# EasyEDA Pro project BtPluggy.epro

# Schematic Schematics
Board Name: Board1; Create Date: 2026-01-23; Page Name: P1; Project Name: BtPluggy; Schematic Name: Schematics; Update Date: 2026-03-08; Company: EasyEDA.com; Page Size: A4; Version: V1.0
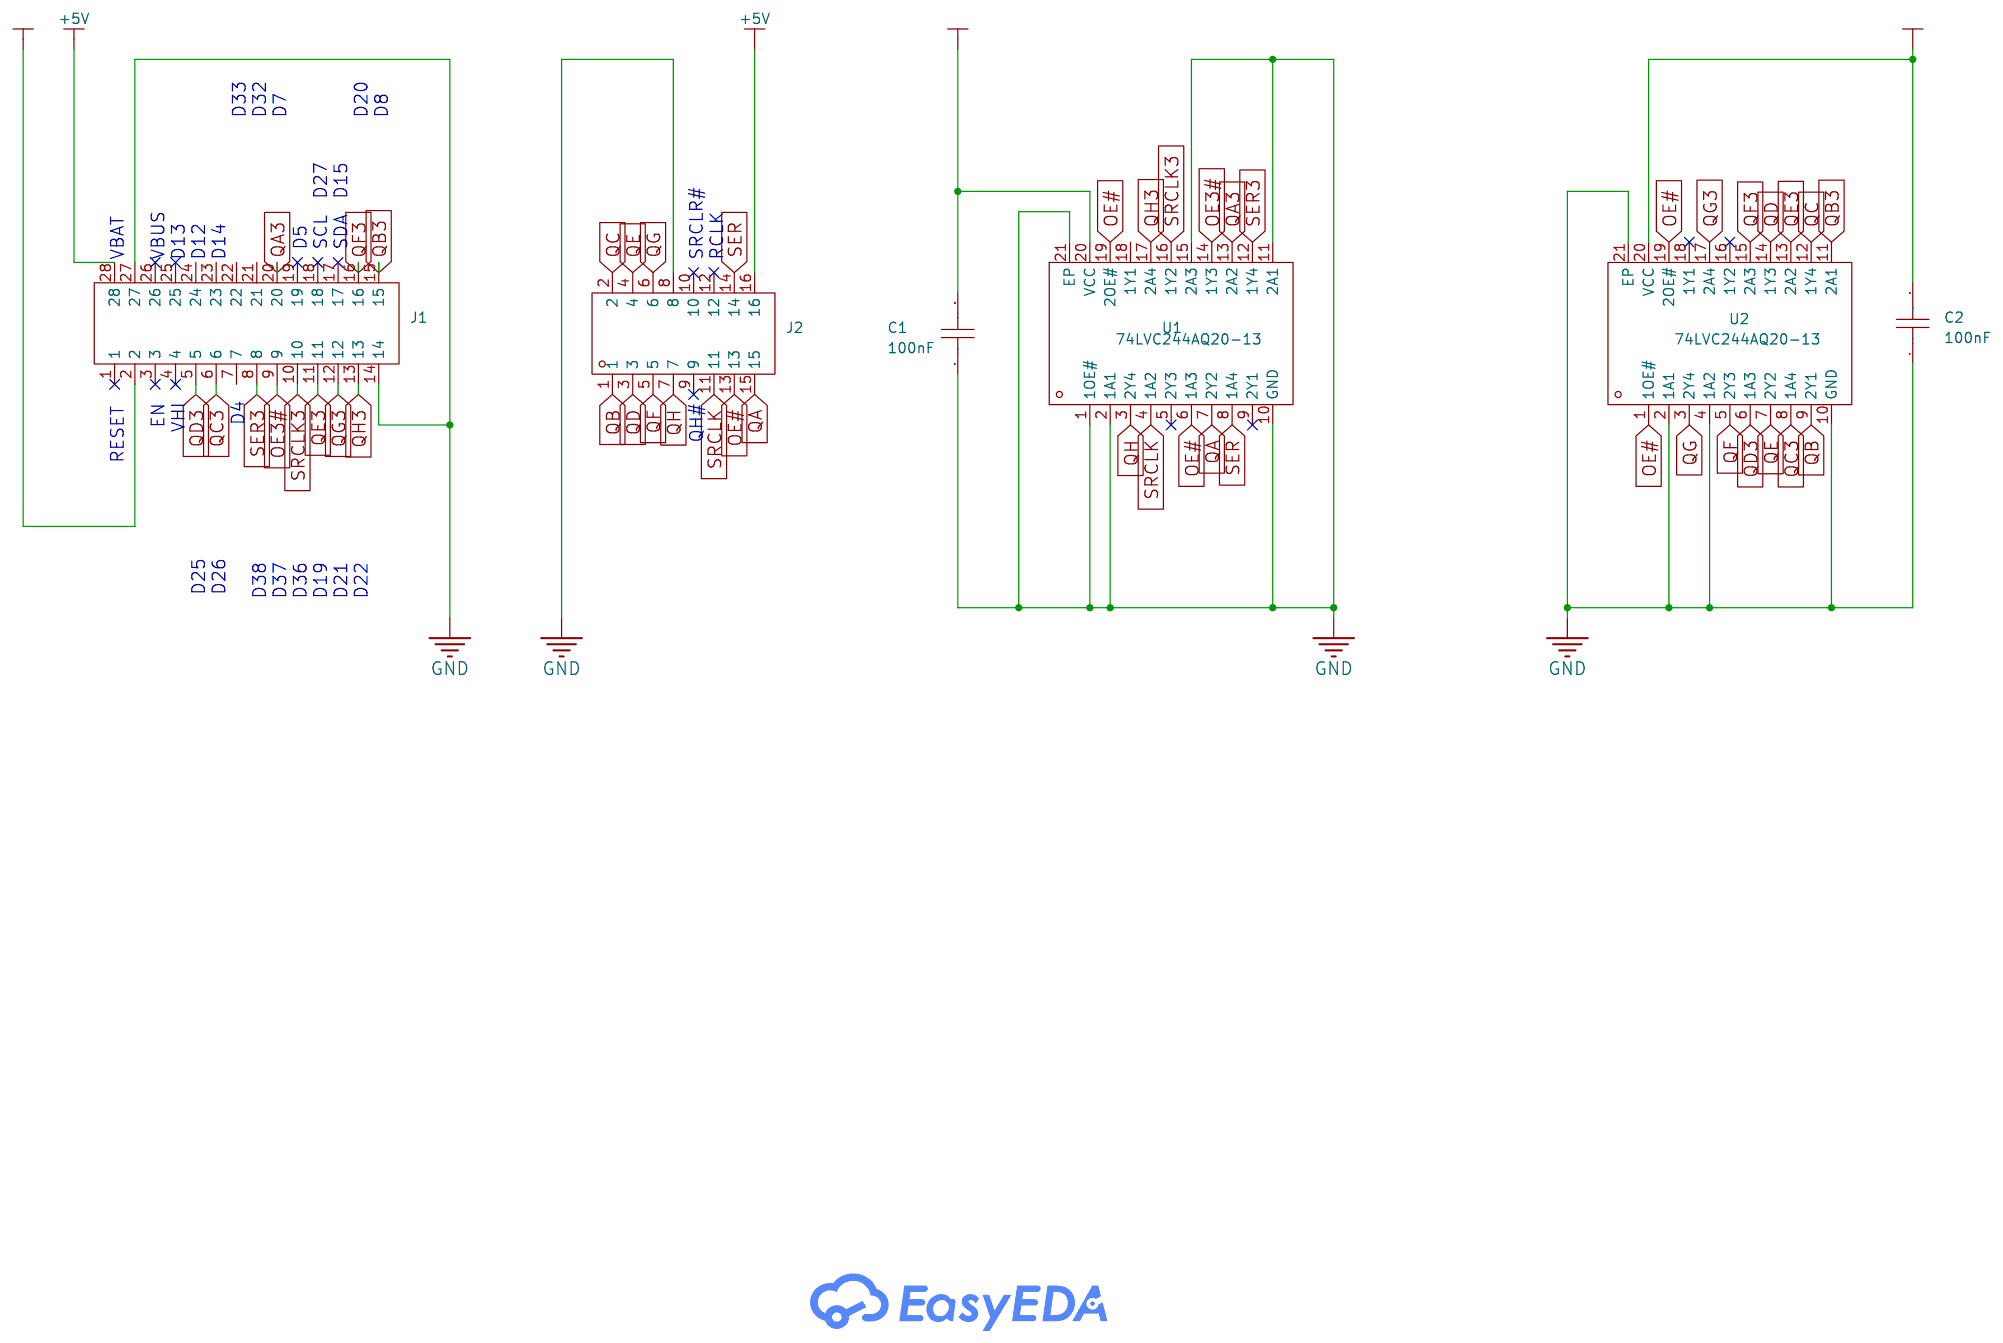
[diagram p0: schematic sheet]

## Parts
C1  100nF  [C0402]
C2  100nF  [C0402]
J1  100-286-100-1001-00  [DIP-28_L35.6-W17.8-P2.54-LS15.2-BL_DILB28P]  (no BOM)
J2  Z-100163200100100  [DIP-16_L20.3-W10.2-P2.54-LS7.6-BL]  (no BOM)
U1  74LVC244AQ20-13  [V-QFN4525-20_L4.5-W2.5-P0.50-BL]
U2  74LVC244AQ20-13  [V-QFN4525-20_L4.5-W2.5-P0.50-BL]

## Library data of the parts
C1 C2 = CL05B104KO5NNNC: Capacitance:100nF Tolerance:±10% Tolerance:±10% Voltage Rating:16V Temperature Coefficient:X7R; LCSC Part Name: 100nF ±10% 16V; Supplier Part: C1525; Manufacturer: SAMSUNG(三星); Supplier Footprint: 0402; JLCPCB Part Class: Basic Part; Datasheet: https://item.szlcsc.com/datasheet/CL05B104KO5NNNC/1877.html; Supplier: LCSC; Tolerance: ±10%; Voltage Rating: 16V; Temperature Coefficient: X7R
J1 = 100-286-100-1001-00: IC Type:DIP Pitch:2.54mm Row Spacing:15.24mm Circular Holes/Square Holes:Circular Holes Number of Positions:28P Operating Temperature Range:- Operating Temperature Range:-; LCSC Part Name: 间距2.54mm P数:28P 圆孔; Supplier Part: C2846073; Manufacturer: Nextron(正凌); Supplier Footprint: DIP-28; JLCPCB Part Class: Extended Part; Datasheet: https://atta.szlcsc.com/upload/public/pdf/source/20210723/C2846073_EB158C8AF85AB1D997D3E99E22413B30.pdf; Supplier: LCSC; IC Type: DIP; Pitch: 2.54mm; Row Spacing: 15.24mm; Circular Holes/Square Holes: Circular Holes; Number of Positions: 28P
J2 = Z-100163200100100: IC Type:DIP Pitch:2.54mm Row Spacing:7.62mm Circular Holes/Square Holes:Circular Holes Number of Positions:16P Operating Temperature Range:-55℃~+125℃ Operating Temperature Range:-55℃~+125℃; LCSC Part Name: 间距2.54mm P数:16P 圆孔; Supplier Part: C2886329; Manufacturer: Nextron(正凌); Supplier Footprint: DIP-16; JLCPCB Part Class: Extended Part; Datasheet: https://atta.szlcsc.com/upload/public/pdf/source/20210712/C115171_600538288BC4983AE5CE40C4C7984B52.pdf; Supplier: LCSC; IC Type: DIP; Pitch: 2.54mm; Row Spacing: 7.62mm; Circular Holes/Square Holes: Circular Holes; Number of Positions: 16P; Operating Temperature Range: -55℃~+125℃
U1 U2 = 74LVC244AQ20-13: Supplier Part: C460536; Manufacturer: DIODES(美台); Supplier Footprint: VQFN-20(2.5x4.5); JLCPCB Part Class: Extended Part; Datasheet: https://item.szlcsc.com/datasheet/74LVC244AQ20-13/464965.html; Supplier: LCSC

## Nets
+5V: J1.28 J2.16
GND: C1.1 C2.1 J1.14 J1.27 J2.8 U1.1(1OE#) U1.2(1A1) U1.10(GND) U1.11(2A1) U1.15(2A3) U1.21(EP) U2.2(1A1) U2.4(1A2) U2.10(GND) U2.21(EP)
V33: C1.2 C2.2 J1.2 U1.20(VCC) U2.20(VCC)
OE3#: J1.9 U1.14(1Y3)
OE#: J2.13 U1.6(1A3) U1.19(2OE#) U2.1(1OE#) U2.19(2OE#)
QA: J2.15 U1.7(2Y2)
QA3: J1.20 U1.13(2A2)
QB: J2.1 U2.9(2Y1)
QB3: J1.15 U2.11(2A1)
QC: J2.2 U2.12(1Y4)
QC3: J1.6 U2.8(1A4)
QD: J2.3 U2.14(1Y3)
QD3: J1.5 U2.6(1A3)
QE: J2.4 U2.7(2Y2)
QE3: J1.11 U2.13(2A2)
QF: J2.5 U2.5(2Y3)
QF3: J1.16 U2.15(2A3)
QG: J2.6 U2.3(2Y4)
QG3: J1.12 U2.17(2A4)
QH: J2.7 U1.3(2Y4)
QH3: J1.13 U1.17(2A4)
SER: J2.14 U1.8(1A4)
SER3: J1.8 U1.12(1Y4)
SRCLK: J2.11 U1.4(1A2)
SRCLK3: J1.10 U1.16(1Y2)

Not connected (* = marked no-connect by the designer): J1 1* 3* 4* 7 17* 18* 19* 21 22 23 24 25* 26*; J2 9* 10* 12*; U1 5(2Y3)* 9(2Y1)* 18(1Y1); U2 16(1Y2)* 18(1Y1)*

## Notes on the sheet
- D33
- D32
- D7
- D20
- D8
- D27
- D15
- D5
- SCL
- SDA
- VBAT
- VBUS
- D13
- D12
- D14
- SRCLR#
- RCLK
- EN
- VHI
- D4
- QH#
- RESET
- D25
- D26
- D38
- D37
- D36
- D19
- D21
- D22

# Board PCB1
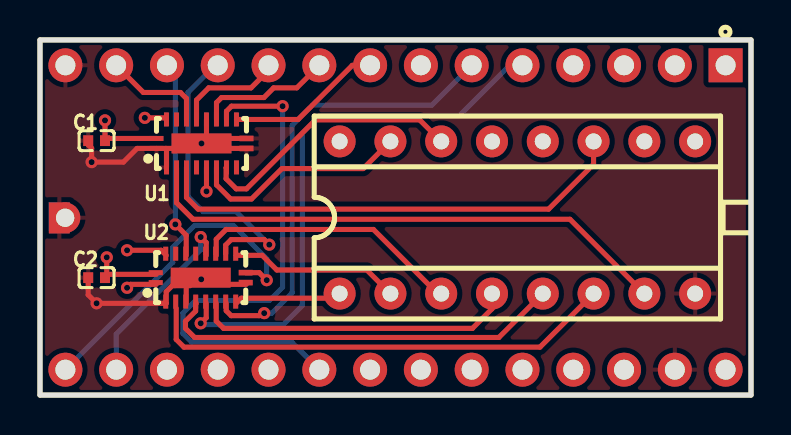
[diagram p1: board, top side]
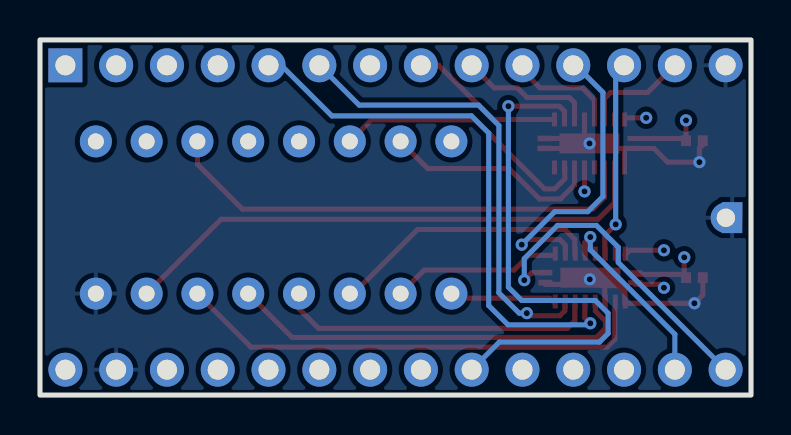
[diagram p2: board, bottom side, seen from below]

Outline 35.56 x 17.78 mm; copper layers: Top Layer, Inner1, Inner2, Bottom Layer. Coordinates in mm from the lower left corner of the outline.
Outline path: rectangle 35.56,0 0,17.78
Stack: Top Layer 0.035mm Outer layer thickness 1oz / Dielectric1 0.2104mm 7628 RC49% 8.6mil / Inner1 0.0152mm Inner layer thickness / Dielectric2 1.065mm 1.1mm H/HOZ Copper / Inner2 0.0152mm Inner layer thickness / Dielectric3 0.2104mm 7628 RC49% 8.6mil / Bottom Layer 0.035mm Outer layer thickness 1oz

## Design rules (mm)
template: JLCPCB Capability(Two Layers Board)
spacing copperThickness1oz (default): track to track 0.102, other pairs 0.152 to 0.3
spacing copperThickness2oz: track to track 0.203, other pairs 0.152 to 0.3
track width copperThickness1oz (default): min 0.127, default 0.254, max 2.54
track width copperThickness2oz: min 0.203, default 0.254, max 2.54
differential pair differentialPair (default): width min 0.127, default 0.254, max 2.54; gap min 0.152, default 0.152
via viaSize (default): diameter min 0.5, default 0.61, max 10; hole min 0.3, default 0.305, max 6.3

## Placement (name value [footprint] x y rotation side)
C1  100nF  [C0402]  2.83 12.74 0 top
C2  100nF  [C0402]  2.83 5.88 0 top
J1  100-286-100-1001-00  [DIP-28_L35.6-W17.8-P2.54-LS15.2-BL_DILB28P]  17.78 8.89 180 top
J2  Z-100163200100100  [DIP-16_L20.3-W10.2-P2.54-LS7.6-BL]  23.88 8.89 0 top
NOREF  -  [Pad_e25]  0.97 8.87 0 top
NOREF#2  -  [Pad_e24]  0.94 8.89 0 top
NOREF#3  -  [Pad_e12]  1.26 8.88 0 top
U1  74LVC244AQ20-13  [V-QFN4525-20_L4.5-W2.5-P0.50-BL]  8.08 12.6 0 top
U2  74LVC244AQ20-13  [V-QFN4525-20_L4.5-W2.5-P0.50-BL]  8.04 5.88 0 top

## Footprints (pads in the part's own frame, mm; a bottom-side part is the same pattern mirrored in y, then rotated)
C0402
  rect 0.5x0.54 smd: 1(-0.42,0) 2(0.42,0)
DIP-16_L20.3-W10.2-P2.54-LS7.6-BL
  round 1.6 hole 0.8: 1(-8.89,-3.81) 2(-6.35,-3.81) 3(-3.81,-3.81) 4(-1.27,-3.81) 5(1.27,-3.81) 6(3.81,-3.81) 7(6.35,-3.81) 8(8.89,-3.81) 9(8.89,3.81) 10(6.35,3.81) 11(3.81,3.81) 12(1.27,3.81) 13(-1.27,3.81) 14(-3.81,3.81) 15(-6.35,3.81) 16(-8.89,3.81)
DIP-28_L35.6-W17.8-P2.54-LS15.2-BL_DILB28P
  rect 1.7x1.7 hole 1: 1(-16.51,-7.62)
  round 1.7 hole 1: 2(-13.97,-7.62) 3(-11.43,-7.62) 4(-8.89,-7.62) 5(-6.35,-7.62) 6(-3.81,-7.62) 7(-1.27,-7.62) 8(1.27,-7.62) 9(3.81,-7.62) 10(6.35,-7.62) 11(8.89,-7.62) 12(11.43,-7.62) 13(13.97,-7.62) 14(16.51,-7.62) 15(16.51,7.62) 16(13.97,7.62) 17(11.43,7.62) 18(8.89,7.62) 19(6.35,7.62) 20(3.81,7.62) 21(1.27,7.62) 22(-1.268,7.62) 23(-3.81,7.62) 24(-6.35,7.62) 25(-8.89,7.62) 26(-11.43,7.62) 27(-13.97,7.62) 28(-16.51,7.62)
Pad_e12
  round 1.524 hole 0.914: (0,0)
Pad_e24
  custom 1.04x1.549 smd far side: 1(0,0)
Pad_e25
  custom 1.05x1.558 smd: 2(0,0)
V-QFN4525-20_L4.5-W2.5-P0.50-BL
  rect 0.7x0.25 smd: 1(-2.251,-0.249) 20(-2.251,0.249)
  rect 0.25x0.7 smd: 2(-1.75,-1.2) 3(-1.25,-1.2) 4(-0.75,-1.2) 5(-0.25,-1.2) 6(0.25,-1.2) 7(0.75,-1.2) 8(1.25,-1.2) 9(1.75,-1.2) 12(1.75,1.2) 13(1.25,1.2) 14(0.75,1.2) 15(0.25,1.2) 16(-0.25,1.2) 17(-0.75,1.2) 18(-1.25,1.2) 19(-1.75,1.2)
  rect 0.7x0.28 smd: 10(2.251,-0.249) 11(2.25,0.25)
  rect 3x1 smd: 21(0,0)

## Nets
As in the schematic, except:
GND: C1.1 C2.1 J1.14 J1.27 J2.8 NOREF.2 NOREF#2.1 NOREF#3. U1.1 U1.2 U1.10 U1.11 U1.15 U1.21 U2.2 U2.4 U2.10 U2.21

Pads without a net: J1 1 3 4 7 17 18 19 21 22 23 24 25 26; J2 9 10 12; U1 5 9 18; U2 16 18

## Via types
v1: diameter 0.61, hole 0.305, Top Layer to Bottom Layer, 17 vias

## Routing (per net, layer and track width the routed paths; a pad name or vN(x,y) marks a point on that pad's centre or on a via; arc(x,y) is an arc through that point)
+5V: length 28.6
  Inner2 w1.27: J1.28 34.62,1.6 34.62,6.98 32.8,8.8 17.56,8.8 14.99,11.38 J2.16
GND: length 22.6
  Top Layer w0.254: 7.31,5.44 7.31,4.59 ; U1.2 6.33,12.32 6.3,12.35 ; 6.3,12.35 U1.1 4.86,12.35 4.17,11.66 v1(2.58,11.66) 2.58,12.36 2.41,12.53 C1.1 ; 6.3,12.35 7.83,12.35 ; C2.1 2.41,5.01 v1(2.83,4.59) 6.31,4.59 6.31,5.18 6.62,5.48 7.51,5.48 ; U1.15 8.33,12.85 U1.11 ; v1(8.06,5.79) 8.31,5.54 10.31,5.54 ; U1.10 8.33,12.35
  vias: v1(8.08,12.6)
V33: length 7.2
  Top Layer w0.254: 5.81,6.04 3.42,6.04 3.34,5.97 ; C2.2 3.34,5.97 ; 3.34,5.97 v1(3.34,6.89) ; 5.83,12.85 3.36,12.85 C1.2 v1(3.25,13.75)
OE3#: length 6.8
  Top Layer w0.254: J1.9 12.84,15.38 11.69,15.38 11.2,14.9 9.08,14.9 8.83,14.64 U1.14
OE#: length 36.6
  Top Layer w0.254: U1.19 6.25,13.88 v1(5.24,13.88) ; v1(4.36,7.25) 6.06,7.25 6.31,6.99 ; U1.6 v1(8.33,10.2) ; v1(4.36,5.37) 4.53,5.54 5.81,5.54
  Inner2 w0.254: J2.13 21.43,13.88 v1(5.24,13.88) 4.36,12.99 4.36,10.2 ; 4.36,10.2 v1(4.36,7.25) v1(4.36,5.37) ; 4.36,10.2 v1(8.33,10.2)
QA: length 11.1
  Top Layer w0.254: J2.15 16.17,11.34 12.1,11.34 10.58,9.82 9.53,9.82 8.83,10.52 U1.7
QA3: length 26.5
  Top Layer w0.254: U1.13 9.33,14.21 9.58,14.46 v1(12.13,14.46)
  Bottom Layer w0.254: J1.20 12.59,2.65 7.58,2.65 7.15,3.08 7.15,4.1 7.78,4.74 11.47,4.74 12.13,5.4 v1(12.13,14.46)
QB: length 5.4
  Top Layer w0.254: 14.99,5.08 14.75,4.85 10.07,4.85 9.81,4.59
QB3: length 16.5
  Top Layer w0.254: v1(11.34,5.75) 10.96,6.13 U2.11
  Bottom Layer w0.254: v1(11.34,5.75) 11.34,6.83 9.68,8.49 7.73,8.49 6.64,7.4 6.64,6.64 J1.15
QC: length 8.5
  Top Layer w0.254: 17.53,5.08 16.35,6.26 11.85,6.26 11.11,6.99 9.81,6.99
QC3: length 22.9
  Top Layer w0.254: v1(11.21,4.1) 11.09,4.1 10.96,3.97 9.56,3.97 9.31,4.22 9.31,4.59
  Bottom Layer w0.254: J1.6 19.59,14.51 13.63,14.51 12.61,13.5 12.61,5.12 11.59,4.1 v1(11.21,4.1)
QD: length 13.6
  Top Layer w0.254: 20.07,5.08 19.89,5.08 16.67,8.29 9.31,8.29 8.81,7.8 8.81,6.99
QD3: length 27.7
  Top Layer w0.254: 8.31,4.59 8.31,3.87 v1(8.04,3.59)
  Bottom Layer w0.254: J1.5 23.5,16.51 20.96,13.98 13.98,13.98 13.12,13.12 13.12,4.48 12.15,3.52 8.11,3.52 v1(8.04,3.59)
QE: length 16
  Top Layer w0.254: 8.81,4.59 8.81,3.71 9.18,3.34 21.63,3.34 22.61,4.32 22.61,5.08
QE3: length 15.1
  Top Layer w0.254: v1(11.47,7.53) 11.21,7.78 9.56,7.78 9.29,7.51 U2.13
  Bottom Layer w0.254: v1(11.47,7.53) 9.82,9.18 8.16,9.18 7.4,9.94 7.4,15.15 8.76,16.51 J1.11
QF: length 20.4
  Top Layer w0.254: 7.81,4.59 7.78,4.56 7.78,4.2 7.28,3.7 7.28,3.34 7.73,2.88 22.95,2.88 25.15,5.08
QF3: length 9.4
  Top Layer w0.254: v1(8.04,7.91) 8.31,7.63 8.31,6.99
  Bottom Layer w0.254: J1.16 3.81,3.05 8.04,7.28 v1(8.04,7.91)
QG: length 23.7
  Top Layer w0.254: 27.69,5.08 25,2.4 7.2,2.4 6.81,2.78 6.81,4.34
QG3: length 9.9
  Top Layer w0.254: 7.31,6.99 7.31,8 v1(6.77,8.55)
  Bottom Layer w0.254: v1(6.77,8.55) 6.77,16.09 J1.12
QH: length 27.1
  Top Layer w0.254: 30.23,5.08 26.51,8.8 7.66,8.8 6.83,9.63 U1.3
QH3: length 5.3
  Top Layer w0.254: U1.17 7.33,14.84 7.02,15.15 5.17,15.15 J1.13
SER: length 13.4
  Top Layer w0.254: J2.14 18.99,13.78 13.78,13.78 10.32,10.32 9.82,10.32 9.31,10.83 9.31,11.38 U1.8
SER3: length 7.8
  Top Layer w0.254: U1.12 12.91,13.8 15.62,16.51 J1.8
SRCLK: length 24.2
  Top Layer w0.254: U1.4 7.33,9.89 7.91,9.31 25.44,9.31 27.69,11.56 J2.11
SRCLK3: length 5.4
  Top Layer w0.254: J1.10 11.43,16.26 10.56,15.38 8.44,15.38 7.83,14.77 U1.16

## Copper pours and planes (outline as drawn; the poured copper is in the pictures)
GND on Top Layer: 0.17,17.68 35.54,17.68 35.54,0.08 0.17,0.08
GND on Bottom Layer: 0.11,17.52 35.43,17.52 35.43,0.03 0.11,0.03
GND on Inner1: 0.26,17.52 35.3,17.52 35.3,0.26 0.26,0.26
V33 on Inner2: 35.31,0.3 0.25,0.3 0.25,17.78 35.31,17.78

Small or netless copper shapes (teardrops, artwork), in the pictures only: 12 on Inner1
